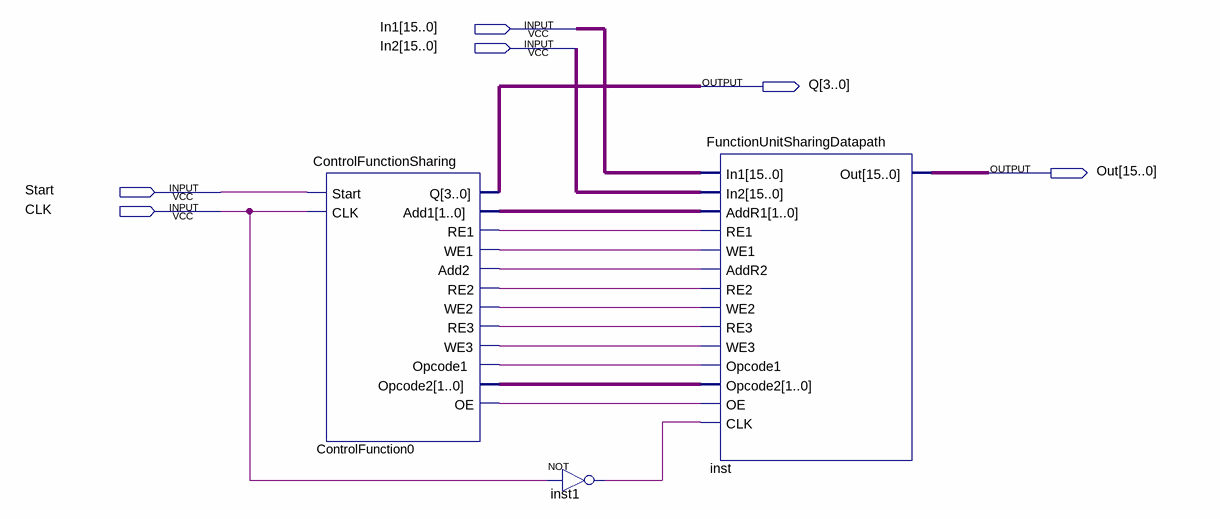
[diagram p0: schematic sheet]
// Quartus schematic FunctionUnitSharing.bdf as structural Verilog: 3 symbols, 6 pins
module FunctionUnitSharing (
  input  [15:0] In1,
  input  [15:0] In2,
  input  Start,
  input  CLK,
  output [3:0] Q,
  output [15:0] Out
);

  wire ControlFunction0_add2, ControlFunction0_oe, ControlFunction0_opcode1, ControlFunction0_re1,
       ControlFunction0_re2, ControlFunction0_re3, ControlFunction0_we1, ControlFunction0_we2,
       ControlFunction0_we3, inst1_out;
  wire [1:0] ControlFunction0_add1, ControlFunction0_opcode2;

  ControlFunctionSharing ControlFunction0 (
    .Start(Start), .CLK(CLK), .Q(Q), .Add1(ControlFunction0_add1), .RE1(ControlFunction0_re1),
    .WE1(ControlFunction0_we1), .Add2(ControlFunction0_add2), .RE2(ControlFunction0_re2),
    .WE2(ControlFunction0_we2), .RE3(ControlFunction0_re3), .WE3(ControlFunction0_we3),
    .Opcode1(ControlFunction0_opcode1), .Opcode2(ControlFunction0_opcode2), .OE(ControlFunction0_oe));
  not inst1 (inst1_out, CLK);
  FunctionUnitSharingDatapath inst (
    .In1(In1), .In2(In2), .AddR1(ControlFunction0_add1), .RE1(ControlFunction0_re1),
    .WE1(ControlFunction0_we1), .AddR2(ControlFunction0_add2), .RE2(ControlFunction0_re2),
    .WE2(ControlFunction0_we2), .RE3(ControlFunction0_re3), .WE3(ControlFunction0_we3),
    .Opcode1(ControlFunction0_opcode1), .Opcode2(ControlFunction0_opcode2), .OE(ControlFunction0_oe),
    .CLK(inst1_out), .Out(Out));
endmodule
